# Altium schematic sheet sch.SchDoc
size A4
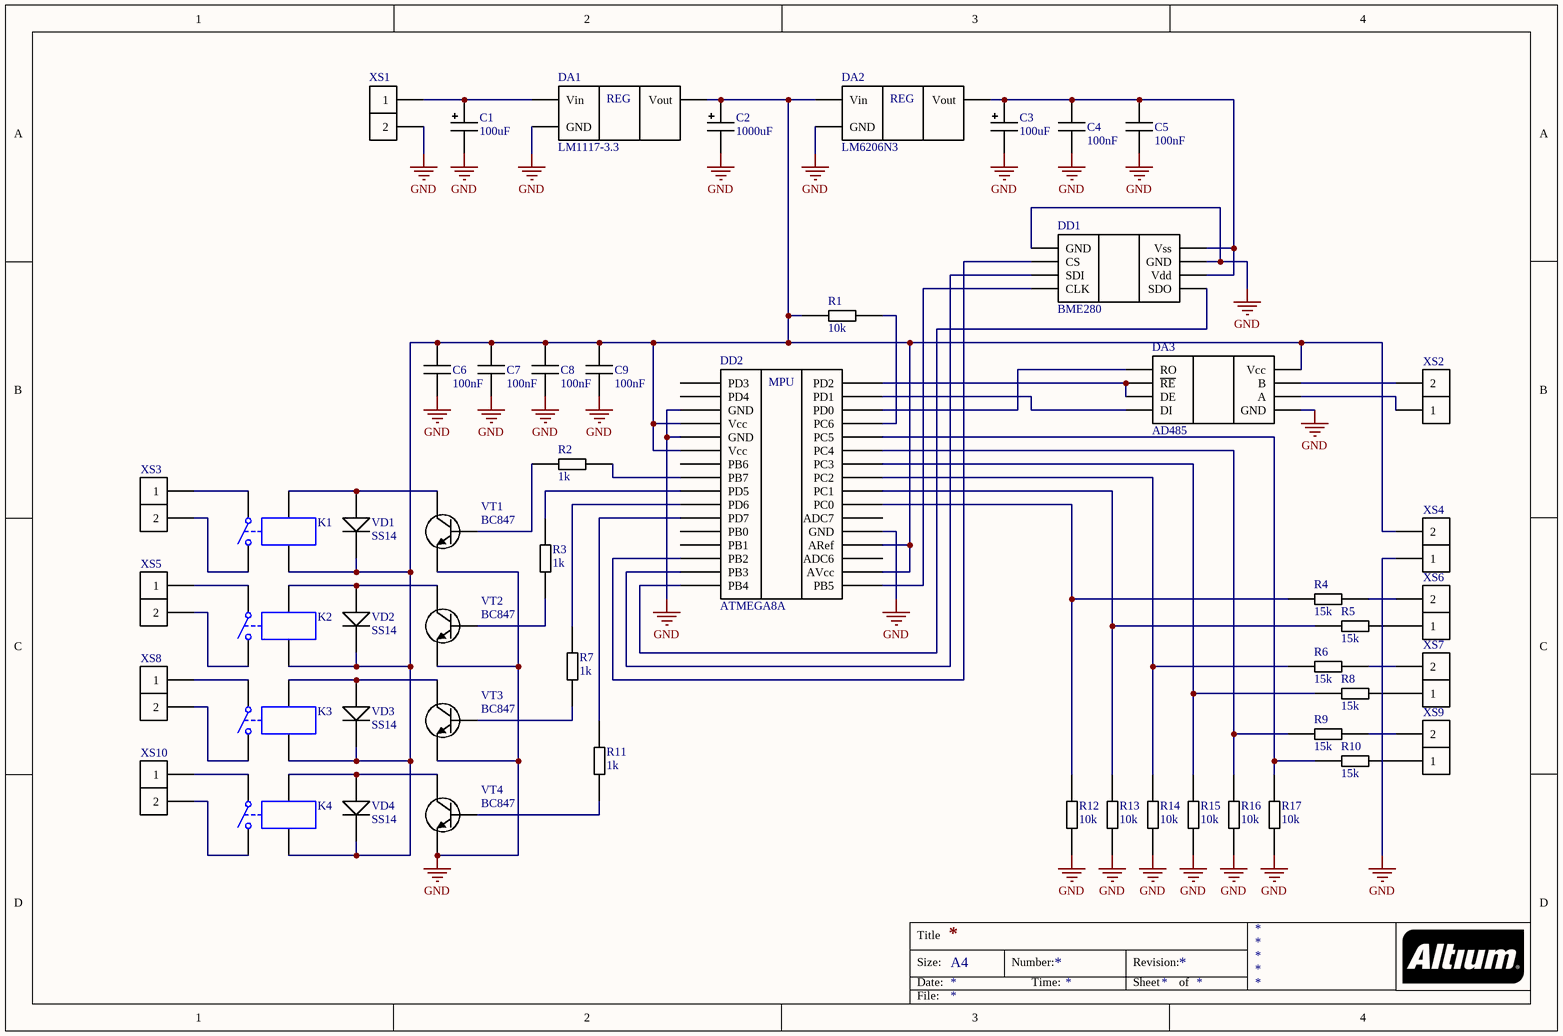
[diagram p0: sch.SchDoc]

## Parts
C1  100uF
C2  1000uF
C3  100uF
C4  100nF
C5  100nF
C6  100nF
C7  100nF
C8  100nF
C9  100nF
DA1  LM1117-3.3
DA2  LM6206N3
DA3  AD485
DD1  BME280
DD2  ATMEGA8A
K1  Relay-SPST  [MODULE4]  (value not drawn)
K2  Relay-SPST  [MODULE4]  (value not drawn)
K3  Relay-SPST  [MODULE4]  (value not drawn)
K4  Relay-SPST  [MODULE4]  (value not drawn)
R1  10k
R2  1k
R3  1k
R4  15k
R5  15k
R6  15k
R7  1k
R8  15k
R9  15k
R10  15k
R11  1k
R12  10k
R13  10k
R14  10k
R15  10k
R16  10k
R17  10k
VD1  SS14  [SMC]
VD2  SS14  [SMC]
VD3  SS14  [SMC]
VD4  SS14  [SMC]
VT1  BC847  [TO-226-AA]
VT2  BC847  [TO-226-AA]
VT3  BC847  [TO-226-AA]
VT4  BC847  [TO-226-AA]
XS1  CONN-2  (value not drawn)
XS2  CONN-2  (value not drawn)
XS3  CONN-2  (value not drawn)
XS4  CONN-2  (value not drawn)
XS5  CONN-2  (value not drawn)
XS6  CONN-2  (value not drawn)
XS7  CONN-2  (value not drawn)
XS8  CONN-2  (value not drawn)
XS9  CONN-2  (value not drawn)
XS10  CONN-2  (value not drawn)

## Nets
GND: C1.2 C2.2 C3.2 C4.2 C5.2 C6.2 C7.2 C8.2 C9.2 DA1.3(GND) DA2.3(GND) DA3.5(GND) DD1.1(GND) DD1.7(GND) DD2.3(GND) DD2.5(GND) DD2.21(GND) R12.2 R13.2 R14.2 R15.2 R16.2 R17.2 VT1.3(E) VT2.3(E) VT3.3(E) VT4.3(E) XS1.2 XS4.1
NetC1_1: C1.1 DA1.1(Vin) XS1.1
NetC2_1: C2.1 C6.1 C7.1 C8.1 C9.1 DA1.2(Vout) DA2.1(Vin) DA3.8(Vcc) DD2.4(Vcc) DD2.6(Vcc) DD2.18(AVcc) DD2.20(ARef) K1.4 K2.4 K3.4 K4.4 R1.2 VD1.2(K) VD2.2(K) VD3.2(K) VD4.2(K) XS4.2
NetC3_1: C3.1 C4.1 C5.1 DA2.2(Vout) DD1.6(Vdd) DD1.8(Vss)
NetDA3_1: DA3.1(RO) DD2.30(PD0)
NetDA3_2: DA3.2(~{RE}) DA3.3(DE) DD2.32(PD2)
NetDA3_4: DA3.4(DI) DD2.31(PD1)
NetDA3_6: DA3.6(A) XS2.1
NetDA3_7: DA3.7(B) XS2.2
NetDD1_2: DD1.2(CS) DD2.14(PB2)
NetDD1_3: DD1.3(SDI) DD2.15(PB3)
NetDD1_4: DD1.4(CLK) DD2.17(PB5)
NetDD1_5: DD1.5(SDO) DD2.16(PB4)
NetDD2_8: DD2.8(PB7) R2.1
NetDD2_9: DD2.9(PD5) R3.1
NetDD2_10: DD2.10(PD6) R7.1
NetDD2_11: DD2.11(PD7) R11.1
NetDD2_23: DD2.23(PC0) R4.1 R12.1
NetDD2_24: DD2.24(PC1) R5.1 R13.1
NetDD2_25: DD2.25(PC2) R6.1 R14.1
NetDD2_26: DD2.26(PC3) R8.1 R15.1
NetDD2_27: DD2.27(PC4) R9.1 R16.1
NetDD2_28: DD2.28(PC5) R10.1 R17.1
NetDD2_29: DD2.29(PC6) R1.1
NetK1_1: K1.1 XS3.1
NetK1_2: K1.2 XS3.2
NetK1_3: K1.3 VD1.1(A) VT1.1(C)
NetK2_1: K2.1 XS5.1
NetK2_2: K2.2 XS5.2
NetK2_3: K2.3 VD2.1(A) VT2.1(C)
NetK3_1: K3.1 XS8.1
NetK3_2: K3.2 XS8.2
NetK3_3: K3.3 VD3.1(A) VT3.1(C)
NetK4_1: K4.1 XS10.1
NetK4_2: K4.2 XS10.2
NetK4_3: K4.3 VD4.1(A) VT4.1(C)
NetR2_2: R2.2 VT1.2(B)
NetR3_2: R3.2 VT2.2(B)
NetR4_2: R4.2 XS6.2
NetR5_2: R5.2 XS6.1
NetR6_2: R6.2 XS7.2
NetR7_2: R7.2 VT3.2(B)
NetR8_2: R8.2 XS7.1
NetR9_2: R9.2 XS9.2
NetR10_2: R10.2 XS9.1
NetR11_2: R11.2 VT4.2(B)

Not connected (* = marked no-connect by the designer): DD2 1(PD3) 2(PD4) 7(PB6) 12(PB0) 13(PB1) 19(ADC6) 22(ADC7)

## Notes on the sheet
- Title
- Size:
- Date:
- A4
- Number:
- Time:
- Revision:
- Sheet
- of
- File:
- (in symbol ATMEGA8A) MPU
- (in symbol LM1117-3.3) REG

## Library data of the parts
C1-C3 = CAP_POLAR
C4-C9 = CAP_NONPOLAR
DA2 = LM1117-3.3
K1-K4 = Relay-SPST: Single-Pole Single-Throw Relay; Published: 24-Mar-1999; LatestRevisionDate: 17-Jul-2002; LatestRevisionNote: Re-released for DXP Platform.; PackageReference: MODULE4; Publisher: Altium Limited
R1-R17 = RES
VD1-VD4 = Diode: Default Diode; Published: 8-Jun-2000; LatestRevisionDate: 17-Jul-2002; LatestRevisionNote: Re-released for DXP Platform.; PackageVersion: Sep-1996; PackageReference: SMC; Publisher: Altium Limited; PackageDescription: DO-214-AB/SMC; 2 C-Bend Leads; Body 7.9 x 5.9 mm, inc. leads (LxW); Code_JEDEC: DO-214-AB
VT1-VT4 = NPN: NPN Bipolar Transistor; Published: 8-Jun-2000; LatestRevisionDate: 17-Jul-2002; LatestRevisionNote: Re-released for DXP Platform.; PackageReference: TO-226-AA; Publisher: Altium Limited; PackageDescription: TO, Flat Index; 3 In-Line, Axial Leads; Body Dia. 4.8mm; Leads 0.55 x 0.51 mm (max); Code_JEDEC: TO-226-AA